# Altium schematic sheet Main_Sheet.SchDoc
size A3; SheetNumber: 1; SheetTotal: 5
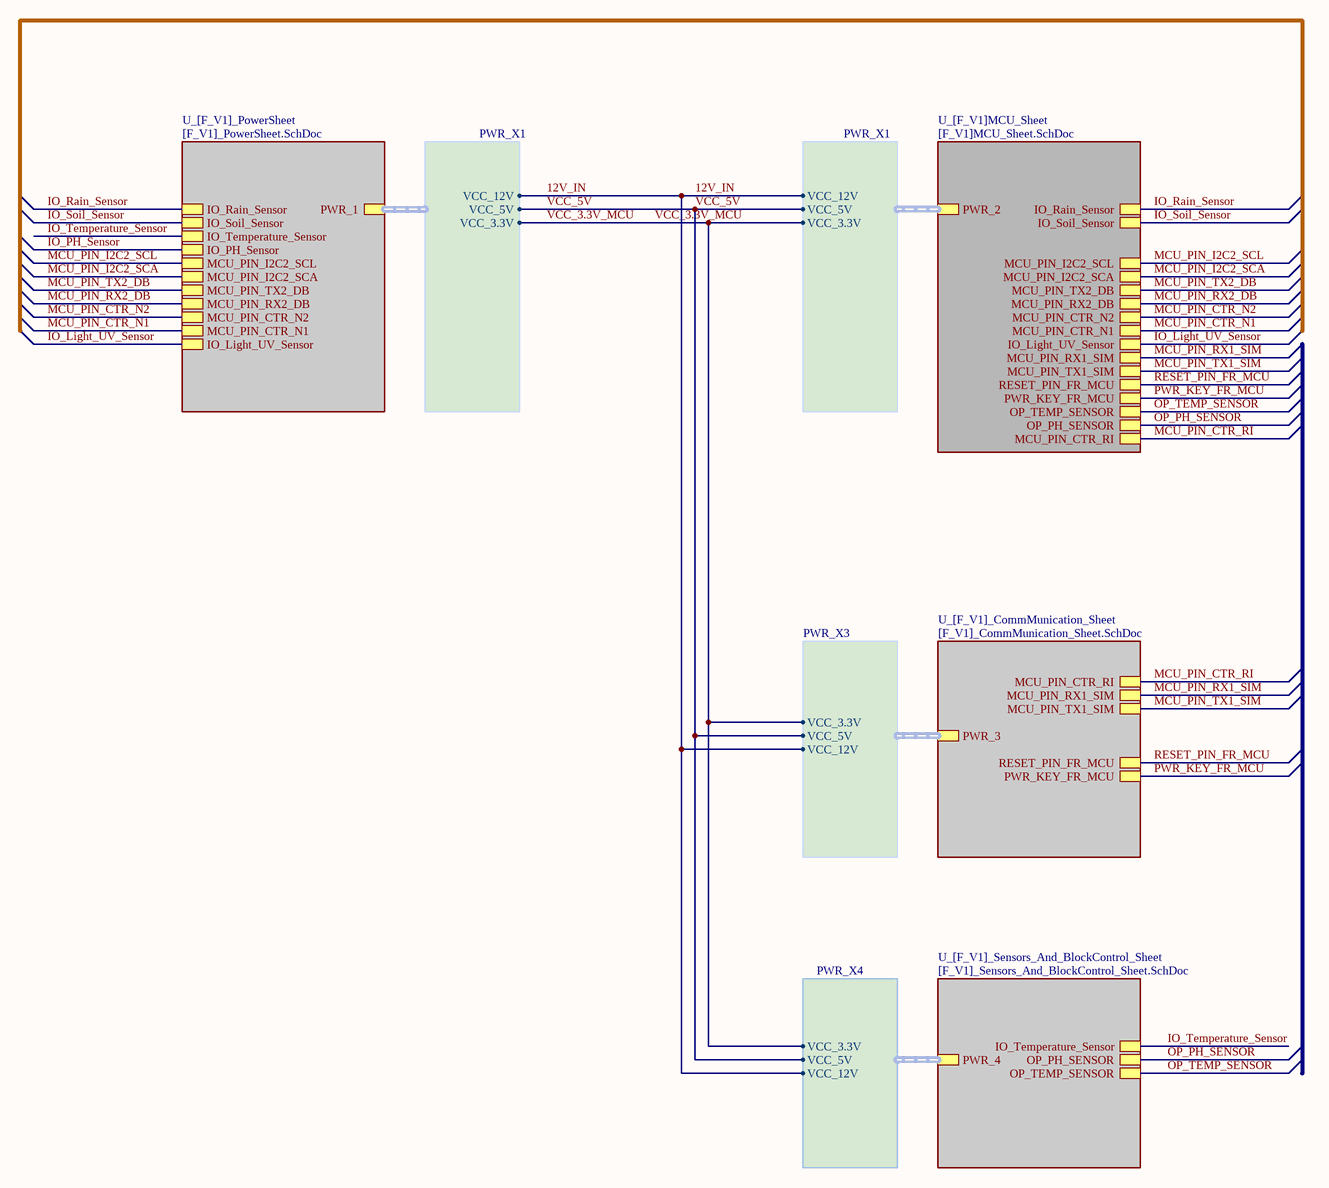
[diagram p0: Main_Sheet.SchDoc]

## Sub-sheets
U_[F_V1]_CommMunication_Sheet = [F_V1]_CommMunication_Sheet.SchDoc: PWR_3 (harness PWR_X3), MCU_PIN_RX1_SIM, MCU_PIN_TX1_SIM, PWR_KEY_FR_MCU, RESET_PIN_FR_MCU, MCU_PIN_CTR_RI
U_[F_V1]_PowerSheet = [F_V1]_PowerSheet.SchDoc: IO_Rain_Sensor, IO_Temperature_Sensor, IO_PH_Sensor, IO_Light_UV_Sensor, PWR_1 (harness PWR_X1), IO_Soil_Sensor, MCU_PIN_CTR_N1, MCU_PIN_CTR_N2, MCU_PIN_I2C2_SCA, MCU_PIN_I2C2_SCL, MCU_PIN_TX2_DB, MCU_PIN_RX2_DB
U_[F_V1]_Sensors_And_BlockControl_Sheet = [F_V1]_Sensors_And_BlockControl_Sheet.SchDoc: PWR_4 (harness PWR_X4), IO_Temperature_Sensor, OP_PH_SENSOR, OP_TEMP_SENSOR
U_[F_V1]MCU_Sheet = [F_V1]MCU_Sheet.SchDoc: IO_Rain_Sensor, OP_TEMP_SENSOR, OP_PH_SENSOR, IO_Light_UV_Sensor, PWR_2 (harness PWR_X1), IO_Soil_Sensor, MCU_PIN_RX2_DB, MCU_PIN_I2C2_SCL, MCU_PIN_I2C2_SCA, MCU_PIN_TX2_DB, MCU_PIN_CTR_N1, MCU_PIN_CTR_N2, MCU_PIN_RX1_SIM, MCU_PIN_TX1_SIM, RESET_PIN_FR_MCU, PWR_KEY_FR_MCU, MCU_PIN_CTR_RI

## Harnesses
PWR_X1: VCC_12V, VCC_5V, VCC_3.3V
PWR_X3: VCC_12V, VCC_5V, VCC_3.3V
PWR_X4: VCC_12V, VCC_5V, VCC_3.3V

## Nets
12V_IN: sheet U_[F_V1]_PowerSheet/PWR_1.VCC_12V, sheet U_[F_V1]MCU_Sheet/PWR_2.VCC_12V, sheet U_[F_V1]_CommMunication_Sheet/PWR_3.VCC_12V, sheet U_[F_V1]_Sensors_And_BlockControl_Sheet/PWR_4.VCC_12V
IO_Light_UV_Sensor: sheet U_[F_V1]_PowerSheet/IO_Light_UV_Sensor, sheet U_[F_V1]MCU_Sheet/IO_Light_UV_Sensor
IO_PH_Sensor: sheet U_[F_V1]_PowerSheet/IO_PH_Sensor
IO_Rain_Sensor: sheet U_[F_V1]_PowerSheet/IO_Rain_Sensor, sheet U_[F_V1]MCU_Sheet/IO_Rain_Sensor
IO_Soil_Sensor: sheet U_[F_V1]_PowerSheet/IO_Soil_Sensor, sheet U_[F_V1]MCU_Sheet/IO_Soil_Sensor
IO_Temperature_Sensor: sheet U_[F_V1]_PowerSheet/IO_Temperature_Sensor, sheet U_[F_V1]_Sensors_And_BlockControl_Sheet/IO_Temperature_Sensor
MCU_PIN_CTR_N1: sheet U_[F_V1]_PowerSheet/MCU_PIN_CTR_N1, sheet U_[F_V1]MCU_Sheet/MCU_PIN_CTR_N1
MCU_PIN_CTR_N2: sheet U_[F_V1]_PowerSheet/MCU_PIN_CTR_N2, sheet U_[F_V1]MCU_Sheet/MCU_PIN_CTR_N2
MCU_PIN_CTR_RI: sheet U_[F_V1]MCU_Sheet/MCU_PIN_CTR_RI, sheet U_[F_V1]_CommMunication_Sheet/MCU_PIN_CTR_RI
MCU_PIN_I2C2_SCA: sheet U_[F_V1]_PowerSheet/MCU_PIN_I2C2_SCA, sheet U_[F_V1]MCU_Sheet/MCU_PIN_I2C2_SCA
MCU_PIN_I2C2_SCL: sheet U_[F_V1]_PowerSheet/MCU_PIN_I2C2_SCL, sheet U_[F_V1]MCU_Sheet/MCU_PIN_I2C2_SCL
MCU_PIN_RX1_SIM: sheet U_[F_V1]MCU_Sheet/MCU_PIN_RX1_SIM, sheet U_[F_V1]_CommMunication_Sheet/MCU_PIN_RX1_SIM
MCU_PIN_RX2_DB: sheet U_[F_V1]_PowerSheet/MCU_PIN_RX2_DB, sheet U_[F_V1]MCU_Sheet/MCU_PIN_RX2_DB
MCU_PIN_TX1_SIM: sheet U_[F_V1]MCU_Sheet/MCU_PIN_TX1_SIM, sheet U_[F_V1]_CommMunication_Sheet/MCU_PIN_TX1_SIM
MCU_PIN_TX2_DB: sheet U_[F_V1]_PowerSheet/MCU_PIN_TX2_DB, sheet U_[F_V1]MCU_Sheet/MCU_PIN_TX2_DB
OP_PH_SENSOR: sheet U_[F_V1]MCU_Sheet/OP_PH_SENSOR, sheet U_[F_V1]_Sensors_And_BlockControl_Sheet/OP_PH_SENSOR
OP_TEMP_SENSOR: sheet U_[F_V1]MCU_Sheet/OP_TEMP_SENSOR, sheet U_[F_V1]_Sensors_And_BlockControl_Sheet/OP_TEMP_SENSOR
PWR_KEY_FR_MCU: sheet U_[F_V1]MCU_Sheet/PWR_KEY_FR_MCU, sheet U_[F_V1]_CommMunication_Sheet/PWR_KEY_FR_MCU
RESET_PIN_FR_MCU: sheet U_[F_V1]MCU_Sheet/RESET_PIN_FR_MCU, sheet U_[F_V1]_CommMunication_Sheet/RESET_PIN_FR_MCU
VCC_3.3V_MCU: sheet U_[F_V1]_PowerSheet/PWR_1.VCC_3.3V, sheet U_[F_V1]MCU_Sheet/PWR_2.VCC_3.3V, sheet U_[F_V1]_CommMunication_Sheet/PWR_3.VCC_3.3V, sheet U_[F_V1]_Sensors_And_BlockControl_Sheet/PWR_4.VCC_3.3V
VCC_5V: sheet U_[F_V1]_PowerSheet/PWR_1.VCC_5V, sheet U_[F_V1]MCU_Sheet/PWR_2.VCC_5V, sheet U_[F_V1]_CommMunication_Sheet/PWR_3.VCC_5V, sheet U_[F_V1]_Sensors_And_BlockControl_Sheet/PWR_4.VCC_5V